# Altium schematic sheet IO.SchDoc
size B
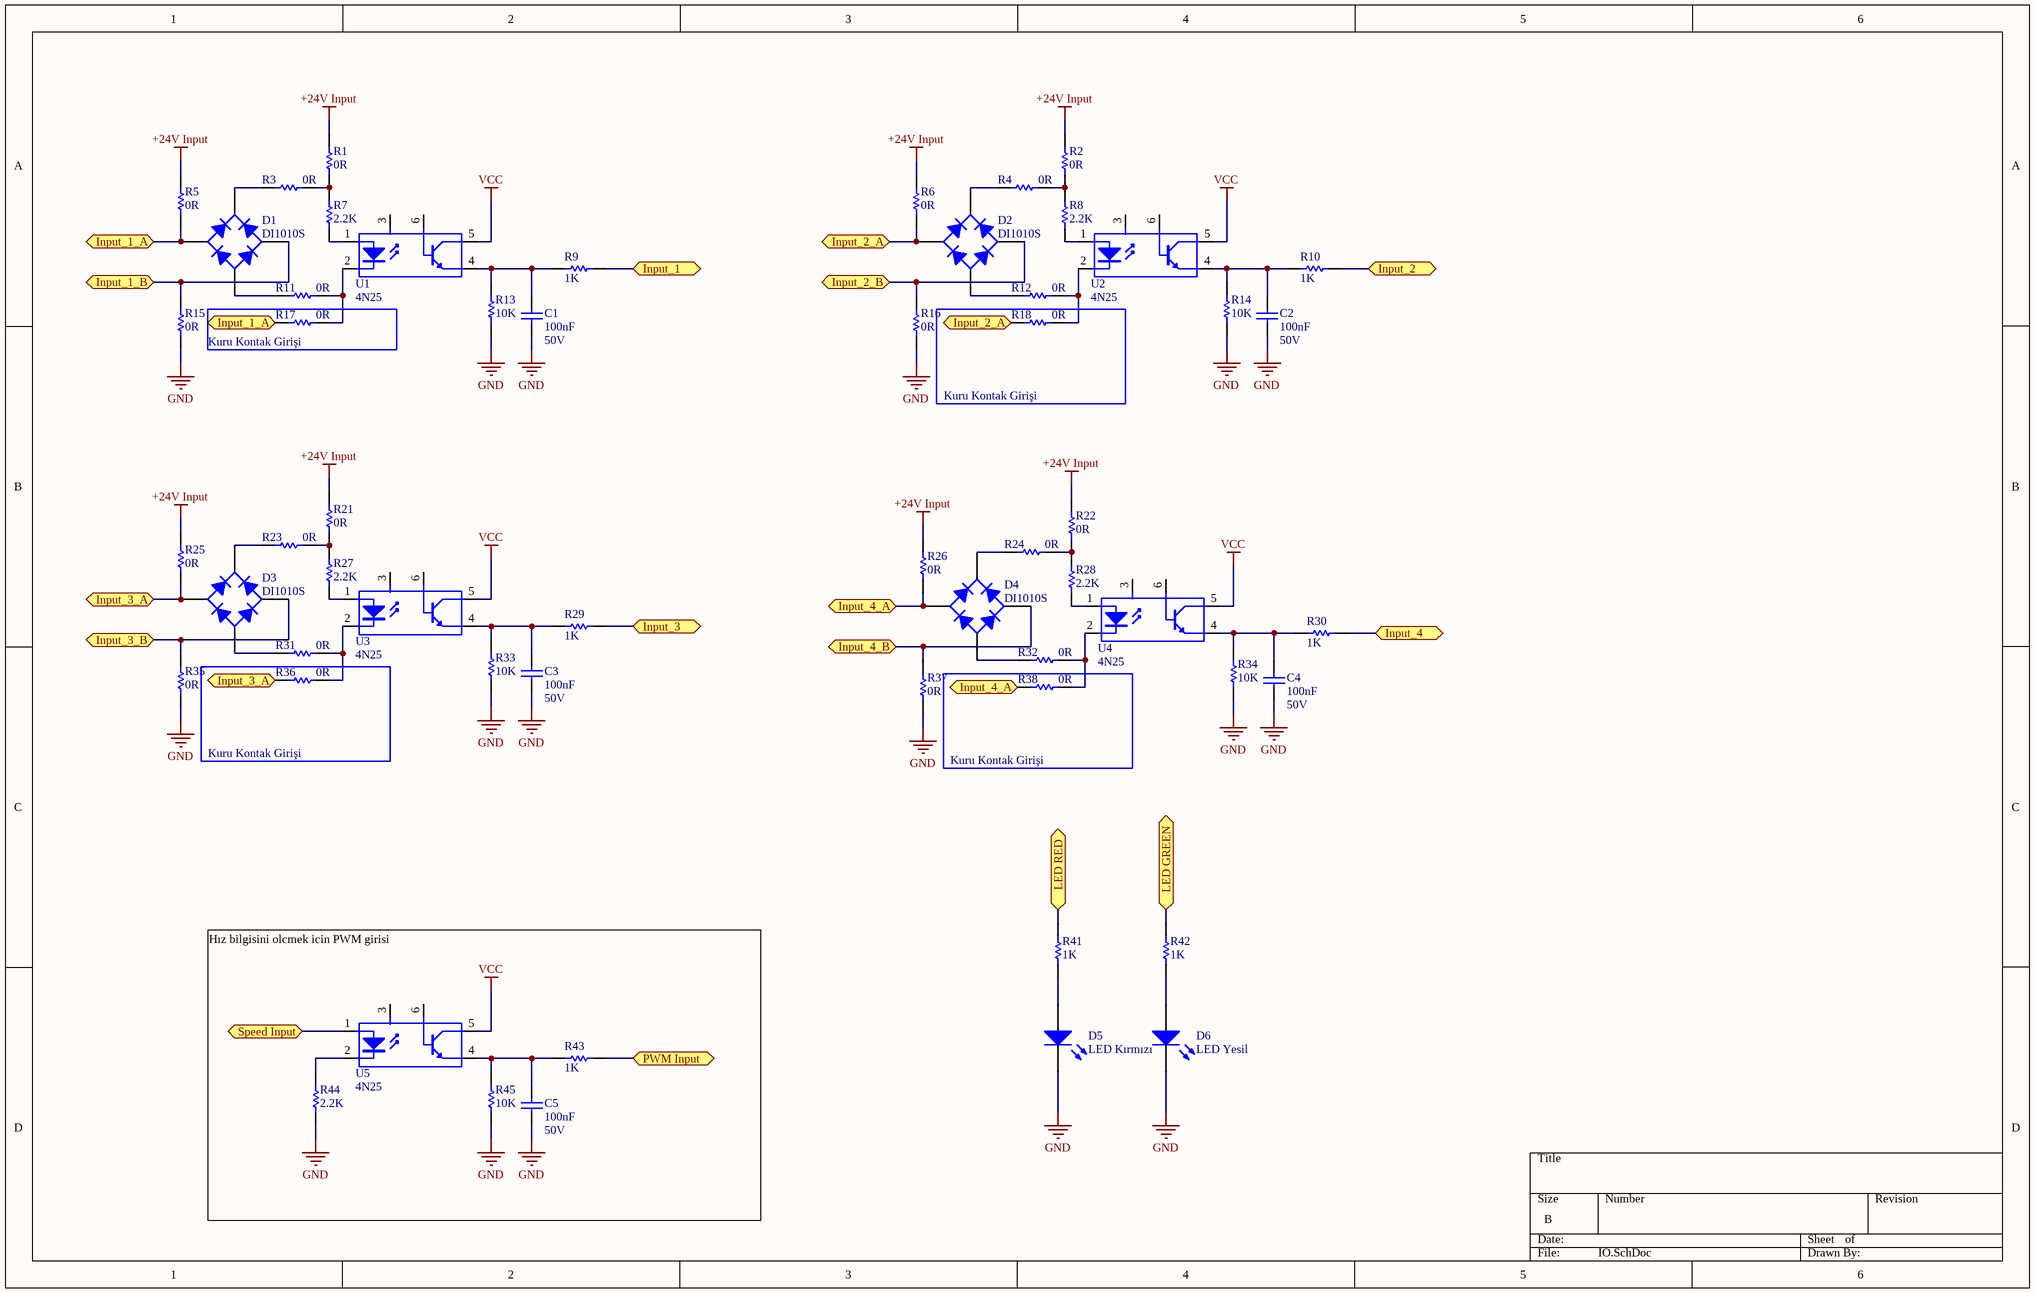
[diagram p0: IO.SchDoc]

## Parts
C1  value 100nF  Voltage: 50V  [3-0603_L]  (hidden comment: Cap)
C2  value 100nF  Voltage: 50V  [3-0603_L]  (hidden comment: Cap)
C3  value 100nF  Voltage: 50V  [3-0603_L]  (hidden comment: Cap)
C4  value 100nF  Voltage: 50V  [3-0603_L]  (hidden comment: Cap)
C5  value 100nF  Voltage: 50V  [3-0603_L]  (hidden comment: Cap)
D1  DI1010S  [DF-S]
D2  DI1010S  [DF-S]
D3  DI1010S  [DF-S]
D4  DI1010S  [DF-S]
D5  LED Kırmızı  [6-0805 - LED]
D6  LED Yesil  [6-0805 - LED]
R1  value 0R  [6-0805_M]  (hidden comment: Res1)
R2  value 0R  [6-0805_M]  (hidden comment: Res1)
R3  value 0R  [6-0805_M]  (hidden comment: Res1)
R4  value 0R  [6-0805_M]  (hidden comment: Res1)
R5  value 0R  [6-0805_M]  (hidden comment: Res1)
R6  value 0R  [6-0805_M]  (hidden comment: Res1)
R7  value 2.2K  [6-0805_M]  (hidden comment: Res1)
R8  value 2.2K  [6-0805_M]  (hidden comment: Res1)
R9  value 1K  [3-0603_L]  (hidden comment: Res1)
R10  value 1K  [3-0603_L]  (hidden comment: Res1)
R11  value 0R  [6-0805_M]  (hidden comment: Res1)
R12  value 0R  [6-0805_M]  (hidden comment: Res1)
R13  value 10K  [3-0603_L]  (hidden comment: Res1)
R14  value 10K  [3-0603_L]  (hidden comment: Res1)
R15  value 0R  [6-0805_M]  (hidden comment: Res1)
R16  value 0R  [6-0805_M]  (hidden comment: Res1)
R17  value 0R  [6-0805_M]  (hidden comment: Res1)
R18  value 0R  [6-0805_M]  (hidden comment: Res1)
R21  value 0R  [6-0805_M]  (hidden comment: Res1)
R22  value 0R  [6-0805_M]  (hidden comment: Res1)
R23  value 0R  [6-0805_M]  (hidden comment: Res1)
R24  value 0R  [6-0805_M]  (hidden comment: Res1)
R25  value 0R  [6-0805_M]  (hidden comment: Res1)
R26  value 0R  [6-0805_M]  (hidden comment: Res1)
R27  value 2.2K  [6-0805_M]  (hidden comment: Res1)
R28  value 2.2K  [6-0805_M]  (hidden comment: Res1)
R29  value 1K  [3-0603_L]  (hidden comment: Res1)
R30  value 1K  [3-0603_L]  (hidden comment: Res1)
R31  value 0R  [6-0805_M]  (hidden comment: Res1)
R32  value 0R  [6-0805_M]  (hidden comment: Res1)
R33  value 10K  [3-0603_L]  (hidden comment: Res1)
R34  value 10K  [3-0603_L]  (hidden comment: Res1)
R35  value 0R  [6-0805_M]  (hidden comment: Res1)
R36  value 0R  [6-0805_M]  (hidden comment: Res1)
R37  value 0R  [6-0805_M]  (hidden comment: Res1)
R38  value 0R  [6-0805_M]  (hidden comment: Res1)
R41  value 1K  [3-0603_L]  (hidden comment: Res1)
R42  value 1K  [3-0603_L]  (hidden comment: Res1)
R43  value 1K  [3-0603_L]  (hidden comment: Res1)
R44  value 2.2K  [6-0805_M]  (hidden comment: Res1)
R45  value 10K  [3-0603_L]  (hidden comment: Res1)
U1  4N25  [DIP-6]
U2  4N25  [DIP-6]
U3  4N25  [DIP-6]
U4  4N25  [DIP-6]
U5  4N25  [DIP-6]

## Blocks framed on the sheet
Kuru Kontak Girişi: R17
Kuru Kontak Girişi: R18
Kuru Kontak Girişi: R36
Kuru Kontak Girişi: R38

## Ports
Input_1, Input_1_A, Input_1_B, Input_2, Input_2_A, Input_2_B, Input_3, Input_3_A, Input_3_B, Input_4, Input_4_A, Input_4_B, LED GREEN (bidir), LED RED (bidir), PWM Input, Speed Input

## Nets
+24V Input: R1.2 R2.2 R5.2 R6.2 R21.2 R22.2 R25.2 R26.2
GND: C1.2 C2.2 C3.2 C4.2 C5.2 D5.2(K) D6.2(K) R13.1 R14.1 R15.1 R16.1 R33.1 R34.1 R35.1 R37.1 R44.1 R45.1
VCC: U1.5(C) U2.5(C) U3.5(C) U4.5(C) U5.5(C)
Input_1: R9.2 ; port Input_1
Input_1_A: D1.2(C) R5.1 R17.2 ; port Input_1_A
Input_1_B: D1.4(C) R15.2 ; port Input_1_B
Input_2: R10.2 ; port Input_2
Input_2_A: D2.2(C) R6.1 R18.2 ; port Input_2_A
Input_2_B: D2.4(C) R16.2 ; port Input_2_B
Input_3: R29.2 ; port Input_3
Input_3_A: D3.2(C) R25.1 R36.2 ; port Input_3_A
Input_3_B: D3.4(C) R35.2 ; port Input_3_B
Input_4: R30.2 ; port Input_4
Input_4_A: D4.2(C) R26.1 R38.2 ; port Input_4_A
Input_4_B: D4.4(C) R37.2 ; port Input_4_B
LED GREEN: R42.2 ; port LED GREEN
LED RED: R41.2 ; port LED RED
PWM Input: R43.2 ; port PWM Input
Speed Input: U5.1(A) ; port Speed Input
NetC1_1: C1.1 R9.1 R13.2 U1.4(E)
NetC2_1: C2.1 R10.1 R14.2 U2.4(E)
NetC3_1: C3.1 R29.1 R33.2 U3.4(E)
NetC4_1: C4.1 R30.1 R34.2 U4.4(E)
NetC5_1: C5.1 R43.1 R45.2 U5.4(E)
NetD1_1: D1.1(A) R11.2
NetD1_3: D1.3(K) R3.2
NetD2_1: D2.1(A) R12.2
NetD2_3: D2.3(K) R4.2
NetD3_1: D3.1(A) R31.2
NetD3_3: D3.3(K) R23.2
NetD4_1: D4.1(A) R32.2
NetD4_3: D4.3(K) R24.2
NetD5_1: D5.1(A) R41.1
NetD6_1: D6.1(A) R42.1
NetR1_1: R1.1 R3.1 R7.1
NetR2_1: R2.1 R4.1 R8.1
NetR7_2: R7.2 U1.1(A)
NetR8_2: R8.2 U2.1(A)
NetR11_1: R11.1 R17.1 U1.2(K)
NetR12_1: R12.1 R18.1 U2.2(K)
NetR21_1: R21.1 R23.1 R27.1
NetR22_1: R22.1 R24.1 R28.1
NetR27_2: R27.2 U3.1(A)
NetR28_2: R28.2 U4.1(A)
NetR31_1: R31.1 R36.1 U3.2(K)
NetR32_1: R32.1 R38.1 U4.2(K)
NetR44_2: R44.2 U5.2(K)

Not connected (* = marked no-connect by the designer): U1 3(NC) 6(B); U2 3(NC) 6(B); U3 3(NC) 6(B); U4 3(NC) 6(B); U5 3(NC) 6(B)

## Notes on the sheet
- Hız bilgisini olcmek icin PWM girisi

## Library data of the parts
C1-C5 = Cap: Capacitor; Published: 8-Jun-2000; Revision: July-2002: Re-released for DXP Platform.; Publisher: Altium Limited
D1-D4 = DI1010S: Full Wave Diode Bridge; Published: 8-Jun-2000; Revision: July-2002: Re-released for DXP Platform.; Publisher: Altium Limited
D5 D6 = LED: Typical INFRARED GaAs LED; Published: 8-Jun-2000; LatestRevisionDate: 08-Jul-2005; LatestRevisionNote: Mech Layer 1 removed.; PackageReference: LED-0; Publisher: Altium Limited
R1-R18 R21-R38 R41-R45 = Res1: Resistor; Published: 8-Jun-2000; LatestRevisionDate: 17-Jul-2002; LatestRevisionNote: Re-released for DXP Platform.; PackageReference: AXIAL-0.3; Publisher: Altium Limited
U1-U5 = 4N25: Published: 24-Mar-1999; LatestRevisionDate: 04-Mar-2005; LatestRevisionNote: PCB Footprint replaced, Sch pins re-numbered.; DatasheetDocument: Apr-2004; PackageReference: SOP5(6); Publisher: Altium Limited